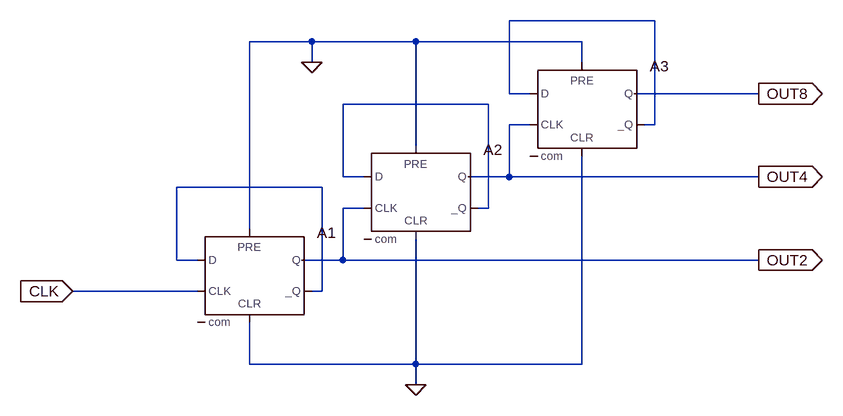
[diagram p0: schematic DIV.asc]
DIV.asc, the LTspice schematic file:
Version 4
SHEET 1 1116 760
WIRE 848 -128 624 -128
WIRE 320 -96 224 -96
WIRE 480 -96 320 -96
WIRE 736 -96 480 -96
WIRE 320 -64 320 -96
WIRE 736 -64 736 -96
WIRE 624 -16 624 -128
WIRE 656 -16 624 -16
WIRE 1008 -16 816 -16
WIRE 592 0 368 0
WIRE 656 32 624 32
WIRE 848 32 848 -128
WIRE 848 32 832 32
WIRE 480 64 480 -96
WIRE 368 112 368 0
WIRE 400 112 368 112
WIRE 624 112 624 32
WIRE 624 112 560 112
WIRE 1008 112 624 112
WIRE 336 128 112 128
WIRE 400 160 368 160
WIRE 592 160 592 0
WIRE 592 160 576 160
WIRE 224 192 224 -96
WIRE 112 240 112 128
WIRE 144 240 112 240
WIRE 368 240 368 160
WIRE 368 240 304 240
WIRE 1008 240 368 240
WIRE 144 288 -48 288
WIRE 336 288 336 128
WIRE 336 288 320 288
WIRE 224 400 224 336
WIRE 480 400 480 208
WIRE 480 400 224 400
WIRE 736 400 736 80
WIRE 736 400 480 400
WIRE 480 432 480 400
FLAG 480 432 0
FLAG -48 288 CLK
IOPIN -48 288 In
FLAG 1008 240 OUT2
IOPIN 1008 240 Out
FLAG 1008 112 OUT4
IOPIN 1008 112 Out
FLAG 1008 -16 OUT8
IOPIN 1008 -16 Out
FLAG 320 -64 0
SYMBOL Digital/dflop 224 192 R0
SYMATTR InstName A1
SYMBOL Digital/dflop 480 64 R0
SYMATTR InstName A2
SYMBOL Digital/dflop 736 -64 R0
SYMATTR InstName A3

The netlist it stands for:
* DIV.asc
A1 N003 0 CLK 0 0 N003 OUT2 0 DFLOP
A2 N002 0 OUT2 0 0 N002 OUT4 0 DFLOP
A3 N001 0 OUT4 0 0 N001 OUT8 0 DFLOP
.backanno
.end